# Altium schematic sheet 04-TFCard_SU03T.SchDoc
size A4; SheetNumber: 3; SheetTotal: 4
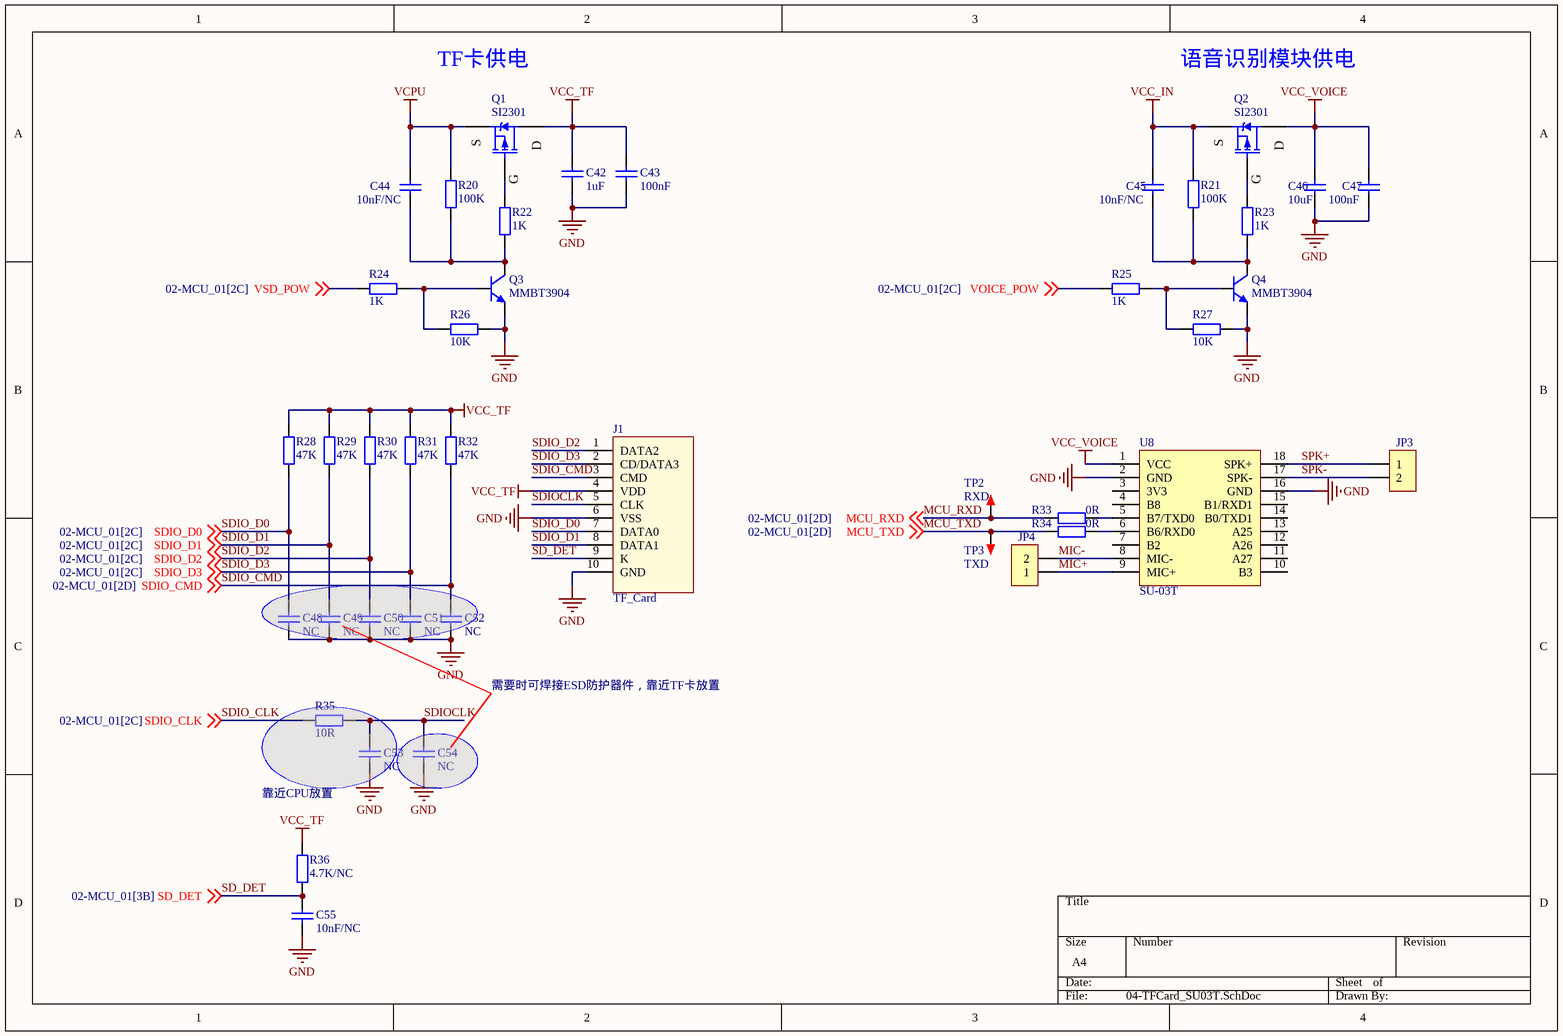
[diagram p0: 04-TFCard_SU03T.SchDoc]

## Parts
C42  1uF  [C0603_M]
C43  100nF  [C0603_M]
C44  10nF/NC  [C0603_M]
C45  10nF/NC  [C0603_M]
C46  10uF  [C0603_M]
C47  100nF  [C0603_M]
C48  NC  [C0402_L]
C49  NC  [C0402_L]
C50  NC  [C0402_L]
C51  NC  [C0402_L]
C52  NC  [C0402_L]
C53  NC  [C0603_M]
C54  NC  [C0402_L]
C55  10nF/NC  [C0603_M]
J1  TF_Card  [Micro SD]
JP3  HDR-1X2  [MX1.25-WT-2P]  (value not drawn)
JP4  HDR-1X2  [MX1.25-WT-2P]  (value not drawn)
Q1  SI2301  [SOT23-3N]
Q2  SI2301  [SOT23-3N]
Q3  MMBT3904  [SOT23-3N]
Q4  MMBT3904  [SOT23-3N]
R20  100K  [R0603_M]
R21  100K  [R0603_M]
R22  1K  [R0603_M]
R23  1K  [R0603_M]
R24  1K  [R0603_M]
R25  1K  [R0603_M]
R26  10K  [R0603_M]
R27  10K  [R0603_M]
R28  47K  [R0603_M]
R29  47K  [R0603_M]
R30  47K  [R0603_M]
R31  47K  [R0603_M]
R32  47K  [R0603_M]
R33  0R  [R0603_M]
R34  0R  [R0603_M]
R35  10R  [R0603_M]
R36  4.7K/NC  [R0603_M]
TP2  RXD  [TEST 1.6]
TP3  TXD  [TEST 1.6]
U8  SU-03T  [SU-03T]

## Nets
GND: C42.1 C43.1 C46.1 C47.1 C48.1 C49.1 C50.1 C51.1 C52.1 C53.1 C54.1 C55.1 J1.6(VSS) J1.10(GND) Q3.2(E) Q4.2(E) R26.1 R27.1 U8.2(GND) U8.16(GND)
VCC_IN: C45.2 Q2.2(S) R21.1
VCC_TF: C42.2 C43.2 J1.4(VDD) Q1.3(D) R28.1 R29.1 R30.1 R31.1 R32.1 R36.1
VCC_VOICE: C46.2 C47.2 Q2.3(D) U8.1(VCC)
VCPU: C44.2 Q1.2(S) R20.1
MCU_RXD: R33.2 TP2.1 ; off-sheet MCU_RXD
MCU_TXD: R34.2 TP3.1 ; off-sheet MCU_TXD
MIC+: JP4.1 U8.9(MIC+)
MIC-: JP4.2 U8.8(MIC-)
SD_DET: C55.2 J1.9(K) R36.2 ; off-sheet SD_DET
SDIO_CLK: R35.2 ; off-sheet SDIO_CLK
SDIO_CMD: C52.2 J1.3(CMD) R32.2 ; off-sheet SDIO_CMD
SDIO_D0: C48.2 J1.7(DATA0) R28.2 ; off-sheet SDIO_D0
SDIO_D1: C49.2 J1.8(DATA1) R29.2 ; off-sheet SDIO_D1
SDIO_D2: C50.2 J1.1(DATA2) R30.2 ; off-sheet SDIO_D2
SDIO_D3: C51.2 J1.2(CD/DATA3) R31.2 ; off-sheet SDIO_D3
SDIOCLK: C53.2 C54.2 J1.5(CLK) R35.1
SPK+: JP3.1 U8.18(SPK+)
SPK-: JP3.2 U8.17(SPK-)
VOICE_POW: R25.2 ; off-sheet VOICE_POW
VSD_POW: R24.2 ; off-sheet VSD_POW
NetC44_1: C44.1 Q3.3(C) R20.2 R22.2
NetC45_1: C45.1 Q4.3(C) R21.2 R23.2
NetQ1_1: Q1.1(G) R22.1
NetQ2_1: Q2.1(G) R23.1
NetQ3_1: Q3.1(B) R24.1 R26.2
NetQ4_1: Q4.1(B) R25.1 R27.2
NetR33_1: R33.1 U8.5(B7/TXD0)
NetR34_1: R34.1 U8.6(B6/RXD0)

Not connected (* = marked no-connect by the designer): U8 3(3V3) 4(B8) 7(B2) 10(B3) 11(A27) 12(A26) 13(A25) 14(B0/TXD1) 15(B1/RXD1)

## Notes on the sheet
- TF卡供电
- 语音识别模块供电
- 需要时可焊接ESD防护器件，靠近TF卡放置
- 靠近CPU放置

## Library data of the parts
C42-C55 = C: 贴片电容/MLCC电容; BOM名称: 无极性贴片电容; 当前库版本V2023.8.14 @淘宝卖家:黄晶宝石: 最新版本发布https://item.taobao.com/item.htm?id=566775463719; 联系下单店铺卖家 免费帮你查找封装: 联系下单店铺卖家 免费技术支持
  C42: value: 1uF
  C43 C47: value: 100nF
  C44 C45 C55: value: 10nF/NC
  C46: value: 10uF
  C48-C54: value: NC
J1 = TF_Card: TF卡座; 当前库版本V2023.8.14 @淘宝卖家:黄晶宝石: 最新版本发布https://item.taobao.com/item.htm?id=566775463719; BOM名称: TF卡座
JP3 JP4 = Header 2: 2P连接器; 联系卖家 免费技术支持: 封装库来自淘宝卖家ID：黄晶宝石; BOM名称: 2P连接器
Q1 Q2 = SI2301: P沟道 20V/2.8A; BOM名称: P沟道场效应管; 联系下单店铺卖家 免费帮你查找封装: 联系下单店铺卖家 免费技术支持
Q3 Q4 = MMBT3904: 高频放大-NPN型; 参数: 40V 0.2A 0.3W 300MHZ; 联系下单店铺卖家 免费帮你查找封装: 联系下单店铺卖家 免费技术支持; BOM名称: 高频放大-NPN型
R20-R36 = R: 贴片电阻; 联系下单店铺卖家 免费帮你查找封装: 联系下单店铺卖家 免费技术支持; BOM名称: 贴片电阻
  R20 R21: value: 100K
  R22-R25: value: 1K
  R26 R27: value: 10K
  R28-R32: value: 47K
  R33 R34: value: 0R
  R35: value: 10R
  R36: value: 4.7K/NC
TP2 TP3 = TEST: 测试点; 联系下单店铺卖家 免费技术支持: 联系下单店铺卖家 免费帮你查找封装; BOM名称: 测试点
U8 = SU-03T: 离线语音识别模块V1.8